# Altium schematic sheet HUB_Sheet1.SchDoc
size A3; PageSetup: Record=PageOptions|CenterHorizontal=True|CenterVertical=True|PrintScale=1.00|XCorrection=1.00|YCorrection=1.00|PrintKind=1|BorderSize=5000000|LeftOffset=0|BottomOffset=0|Orientation=2|PaperLength=1000|PaperWidth=1000|Scale=100|PaperSource=7|PrintQuality=-3|MediaType=1|DitherType=10|PrintScaleMode=1|PaperKind=A3|PaperIndex=8
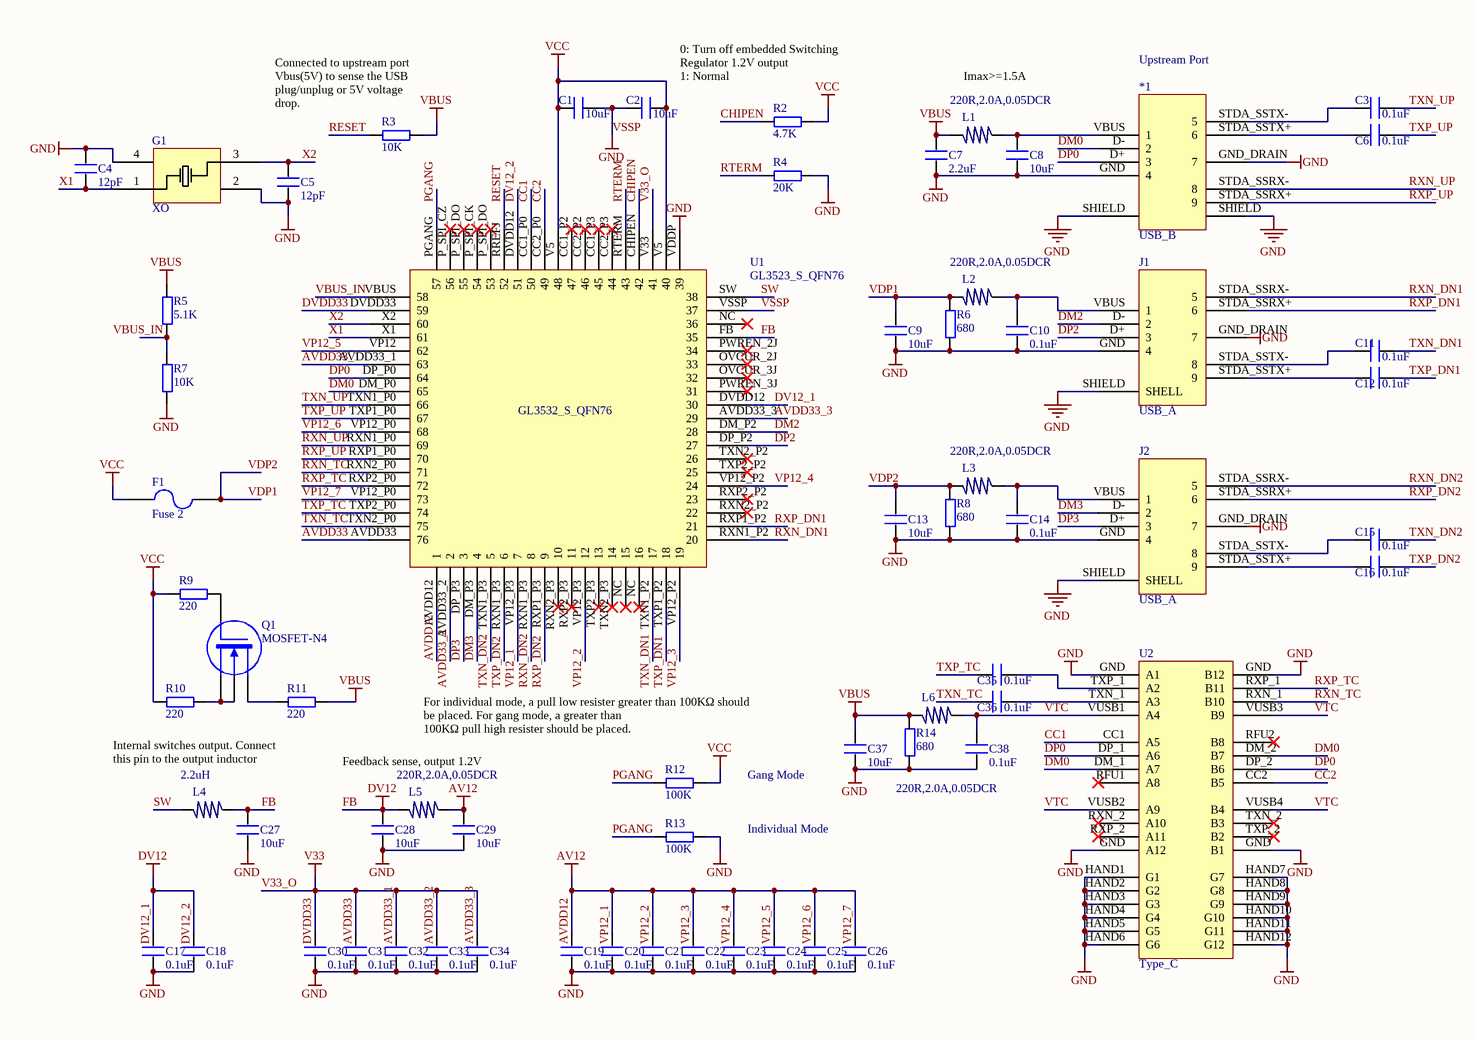
[diagram p0: HUB_Sheet1.SchDoc]

## Parts
*1  USB_B  [USB3.0_TP]
C1  10uF  [0603P]
C2  10uF  [0603P]
C3  0.1uF  [0603P]
C4  12pF  [0603P]
C5  12pF  [0603P]
C6  0.1uF  [0603P]
C7  2.2uF  [0603P]
C8  10uF  [0603P]
C9  10uF  [0603P]
C10  0.1uF  [0603P]
C11  0.1uF  [0603P]
C12  0.1uF  [0603P]
C13  10uF  [0603P]
C14  0.1uF  [0603P]
C15  0.1uF  [0603P]
C16  0.1uF  [0603P]
C17  0.1uF  [0603P]
C18  0.1uF  [0603P]
C19  0.1uF  [0603P]
C20  0.1uF  [0603P]
C21  0.1uF  [0603P]
C22  0.1uF  [0603P]
C23  0.1uF  [0603P]
C24  0.1uF  [0603P]
C25  0.1uF  [0603P]
C26  0.1uF  [0603P]
C27  10uF  [0603P]
C28  10uF  [0603P]
C29  10uF  [0603P]
C30  0.1uF  [0603P]
C31  0.1uF  [0603P]
C32  0.1uF  [0603P]
C33  0.1uF  [0603P]
C34  0.1uF  [0603P]
C35  0.1uF  [0603P]
C36  0.1uF  [0603P]
C37  10uF  [0603P]
C38  0.1uF  [0603P]
F1  Fuse 2  [PIN-W2/E2.8]
G1  XO  [XTAL]
J1  USB_A
J2  USB_A
L1  220R,2.0A,0.05DCR  [0603P]
L2  220R,2.0A,0.05DCR  [0603P]
L3  220R,2.0A,0.05DCR  [0603P]
L4  2.2uH  [0603P]
L5  220R,2.0A,0.05DCR  [0603P]
L6  220R,2.0A,0.05DCR  [0603P]
Q1  MOSFET-N4  [SOT-343_N]
R2  4.7K  [0603P]
R3  10K  [0603P]
R4  20K  [0603P]
R5  5.1K  [0603P]
R6  680  [0603P]
R7  10K  [0603P]
R8  680  [0603P]
R9  220  [0603P]
R10  220  [0603P]
R11  220  [0603P]
R12  100K  [0603P]
R13  100K  [0603P]
R14  680  [0603P]
U1  GL3523_S_QFN76
U2  Type_C

## Nets
AV12: C19.2 C20.2 C21.2 C22.2 C23.2 C24.2 C25.2 C26.2 C29.2 L5.1
FB: C17.2 C18.2 C27.2 C28.2 L4.1 L5.2 U1.FB(35)  [also labelled DV12]
V33_O: C30.2 C31.2 C32.2 C33.2 C34.2 U1.V33(41)  [also labelled V33]
VBUS: C7.2 C37.2 L1.2 L6.2 R3.2 R5.2 R11.2 R14.2
VCC: C1.1 C2.2 F1.1 R2.2 R9.1 R10.1 R12.2 U1.V5(40)
VSSP: *1.GND(4) *1.GND_DRAIN(7) *1.SHIELD C1.2 C2.1 C4.2 C5.1 C7.1 C8.1 C9.1 C10.1 C13.1 C14.1 C17.1 C18.1 C19.1 C20.1 C21.1 C22.1 C23.1 C24.1 C25.1 C26.1 C27.1 C28.1 C29.1 C30.1 C31.1 C32.1 C33.1 C34.1 C37.1 C38.1 G1.2 G1.4 J1.GND(4) J1.GND_DRAIN(7) J1.SHIELD(SHELL) J2.GND(4) J2.GND_DRAIN(7) J2.SHIELD(SHELL) R4.2 R6.1 R7.1 R8.1 R13.2 R14.1 U1.VDDP(39) U1.VSSP(37) U2.GND(A1) U2.HAND1(G1) U2.HAND2(G2) U2.HAND3(G3) U2.HAND4(G4) U2.HAND5(G5) U2.HAND6(G6) U2.HAND7(G7) U2.HAND8(G8) U2.HAND9(G9) U2.HAND10(G10) U2.HAND11(G11) U2.HAND12(G12)  [also labelled GND]
AVDD12: U1.AVDD12(1)
AVDD33: U1.AVDD33(76)
AVDD33_1: U1.AVDD33_1(63)
AVDD33_3: U1.AVDD33_3(29)
CC1: U1.CC1_P0(50) U2.CC1(A5)
CC2: U1.CC2_P0(49) U2.CC2(B5)
CHIPEN: R2.1 U1.CHIPEN(42)
DM0: *1.D-(2) U1.DM_P0(65) U2.DM_1(A7) U2.DM_2(B7)
DM2: J1.D-(2) U1.DM_P2(28)
DM3: J2.D-(2) U1.DM_P3(4)
DP0: *1.D+(3) U1.DP_P0(64) U2.DP_1(A6) U2.DP_2(B6)
DP2: J1.D+(3) U1.DP_P2(27)
DP3: J2.D+(3) U1.DP_P3(3)
DV12_1: U1.DVDD12(30)
DV12_2: U1.DVDD12(51)
DVDD33: U1.DVDD33(59)
PGANG: R12.1 R13.1 U1.PGANG(57)
RESET: R3.1 U1.RREFJ(52)
RTERM: R4.1 U1.RTERM(43)
RXN_DN1: J1.STDA_SSRX-(5) U1.RXN1_P2(20)
RXN_DN2: J2.STDA_SSRX-(5)
RXN_TC: U1.RXN2_P0(71) U2.RXN_1(B10)
RXN_UP: *1.STDA_SSRX-(8) U1.RXN1_P0(69)
RXP_DN1: J1.STDA_SSRX+(6) U1.RXP1_P2(21)
RXP_DN2: J2.STDA_SSRX+(6)
RXP_TC: U1.RXP2_P0(72) U2.RXP_1(B11)
RXP_UP: *1.STDA_SSRX+(9) U1.RXP1_P0(70)
SW: L4.2 U1.SW(38)
TXN_DN1: C11.2
TXN_DN2: C15.2
TXN_TC: C36.1 U1.TXN2_P0(75)
TXN_UP: C3.2 U1.TXN1_P0(66)
TXP_DN1: C12.2
TXP_DN2: C16.2
TXP_TC: C35.1 U1.TXP2_P0(74)
TXP_UP: C6.2 U1.TXP1_P0(67)
VBUS_IN: U1.VBUS(58)
VDP1: C9.2 C13.2 F1.2 L2.2 L3.2 R6.2 R8.2  [also labelled VDP2]
VP12_4: U1.VP12_P2(19)
VP12_5: U1.VP12(62)
VP12_6: U1.VP12_P0(68)
VP12_7: U1.VP12_P0(73)
VTC: C38.2 L6.1 U2.VUSB1(A4) U2.VUSB2(A9) U2.VUSB3(B9) U2.VUSB4(B4)
X1: C4.1 G1.1 U1.X1(61)
X2: C5.2 G1.3 U1.X2(60)
Net*1_STDA_SSTX+: *1.STDA_SSTX+(6) C6.1
Net*1_STDA_SSTX-: *1.STDA_SSTX-(5) C3.1
Net*1_VBUS: *1.VBUS(1) C8.2 L1.1
NetC10_2: C10.2 J1.VBUS(1) L2.1
NetC11_1: C11.1 J1.STDA_SSTX-(8)
NetC12_1: C12.1 J1.STDA_SSTX+(9)
NetC14_2: C14.2 J2.VBUS(1) L3.1
NetC15_1: C15.1 J2.STDA_SSTX-(8)
NetC16_1: C16.1 J2.STDA_SSTX+(9)
NetC35_2: C35.2 U2.TXP_1(A2)
NetC36_2: C36.2 U2.TXN_1(A3)
NetQ1_1: Q1.1(G) R9.2
NetQ1_2: Q1.2(D) R11.1
NetQ1_3: Q1.3(U) Q1.4(S) R10.2
NetR5_1: R5.1 R7.2

Not connected (* = marked no-connect by the designer): U1 AVDD33_2(2) CC1_P2(47)* CC1_P3(45)* CC2_P2(46)* CC2_P3(44)* NC(15)* OVCUR_2J(33)* OVCUR_3J(32)* P_SPI_CK(54)* P_SPI_CZ(56)* P_SPI_DO(53)* PWREN_2J(34)* PWREN_3J(31)* RXN1_P3(6) RXN2_P2(22)* RXN2_P3(10)* RXP1_P3(9) RXP2_P2(23)* RXP2_P3(11)* TXN1_P2(17) TXN1_P3(5) TXN2_P2(26)* TXN2_P3(14)* TXP1_P2(18) TXP2_P2(25)* TXP2_P3(13)* VP12_P3(7); U2 RFU1(A8)* RFU2(B8)* RXN_2(A10)* RXP_2(A11)* TXN_2(B3)* TXP_2(B2)*

## Notes on the sheet
- Upstream Port
- (near R3) Connected to upstream port Vbus(5V) to sense the USB plug/unplug or 5V voltage drop.
- 0: Turn off embedded Switching Regulator 1.2V output
  1: Normal
- Imax>=1.5A
- (near R12) For individual mode, a pull low resister greater than 100KΩ should be placed. For gang mode, a greater than
  100KΩ pull high resister should be placed.
- Internal switches output. Connect
  this pin to the output inductor
- Feedback sense, output 1.2V
- Gang Mode
- Individual Mode
- Labels drawn without touching a wire or pin: AVDD12, AVDD33, AVDD33_1, AVDD33_2, AVDD33_3, DV12_1, DV12_2, DVDD33, RXN_DN2, RXP_DN2, TXN_DN1, TXN_DN2, TXP_DN1, TXP_DN2, VBUS_IN, VP12_1, VP12_2, VP12_3, VP12_4, VP12_5, VP12_6, VP12_7
- (in symbol GL3523_S_QFN76) GL3532_S_QFN76

## Library data of the parts
*1 = USB_B: USB3.0_B
C1-C38 = C
F1 = Fuse 2: Fuse; Published: 8-Jun-2000; LatestRevisionDate: 17-Jul-2002; LatestRevisionNote: Re-released for DXP Platform.; PackageReference: PIN-W2/E2.8; Publisher: Altium Limited; PackageDescription: Thru-Hole; 2 Leads
G1 = XO: 25M XO
J1 J2 = USB_A: USB3.0-A
L1-L6 = L
Q1 = MOSFET-N4: N-Channel MOSFET, Externally Terminated Substrate; Published: 24-Mar-1999; LatestRevisionDate: 29-May-2009; LatestRevisionNote: IPC-7351 Footprint Added.; PackageVersion: Sep-2000; PackageReference: SOT-343; Publisher: Altium Limited; PackageDescription: 4-Pin SOT-343 Package 1.3 mm Pitch, 2.1 mm Lead Span
R2-R14 = R